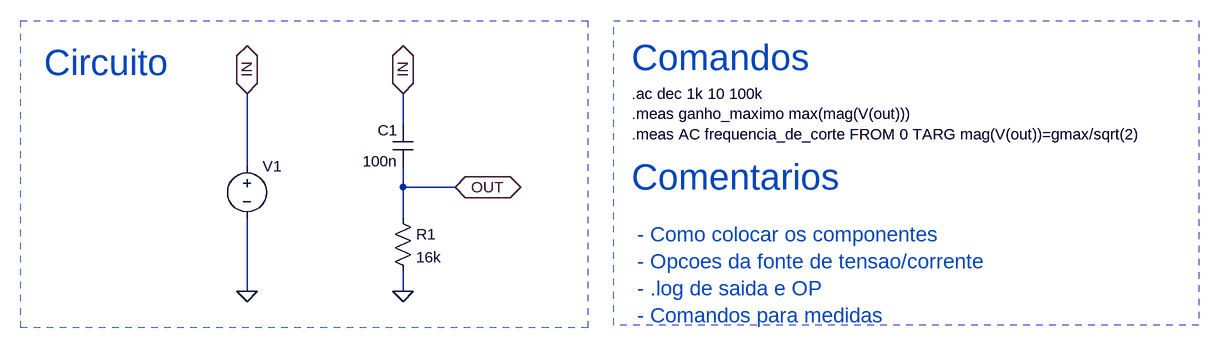
[diagram p0: schematic 3_ac.asc]
3_ac.asc, the LTspice schematic file:
Version 4
SHEET 1 2392 1120
WIRE 320 208 320 160
WIRE 80 272 80 160
WIRE 320 304 320 272
WIRE 400 304 320 304
WIRE 320 352 320 304
WIRE 80 464 80 352
WIRE 320 464 320 432
FLAG 80 464 0
FLAG 80 160 IN
IOPIN 80 160 BiDir
FLAG 320 160 IN
IOPIN 320 160 BiDir
FLAG 320 464 0
FLAG 400 304 OUT
IOPIN 400 304 BiDir
SYMBOL voltage 80 256 R0
SYMATTR InstName V1
SYMATTR Value ""
SYMATTR Value2 AC 1
SYMBOL cap 336 272 R180
WINDOW 0 24 56 Left 2
WINDOW 3 24 8 Left 2
SYMATTR InstName C1
SYMATTR Value 100n
SYMBOL res 304 336 R0
SYMATTR InstName R1
SYMATTR Value 16k
TEXT 672 160 Left 2 !.ac dec 1k 10 100k\n.meas ganho_maximo max(mag(V(out)))\n.meas AC frequencia_de_corte FROM 0 TARG mag(V(out))=gmax/sqrt(2)
TEXT 680 376 Left 3 ;- Como colocar os componentes\n- Opcoes da fonte de tensao/corrente\n- .log de saida e OP\n- Comandos para medidas
TEXT 672 104 Left 5 ;Comandos
TEXT 672 288 Left 5 ;Comentarios
TEXT -232 112 Left 5 ;Circuito
RECTANGLE Normal 644 48 1544 516 2
RECTANGLE Normal -268 48 604 520 2

The netlist it stands for:
* 3_ac.asc
V1 IN 0 AC 1
C1 OUT IN 100n
R1 OUT 0 16k
.ac dec 1k 10 100k
.meas ganho_maximo max(mag(V(out)))
.meas AC frequencia_de_corte FROM 0 TARG mag(V(out))=gmax/sqrt(2)
* - Como colocar os componentes
* - Opcoes da fonte de tensao/corrente
* - .log de saida e OP
* - Comandos para medidas
* Comandos
* Comentarios
* Circuito
.backanno
.end